# Altium project WiRF.PrjPCB
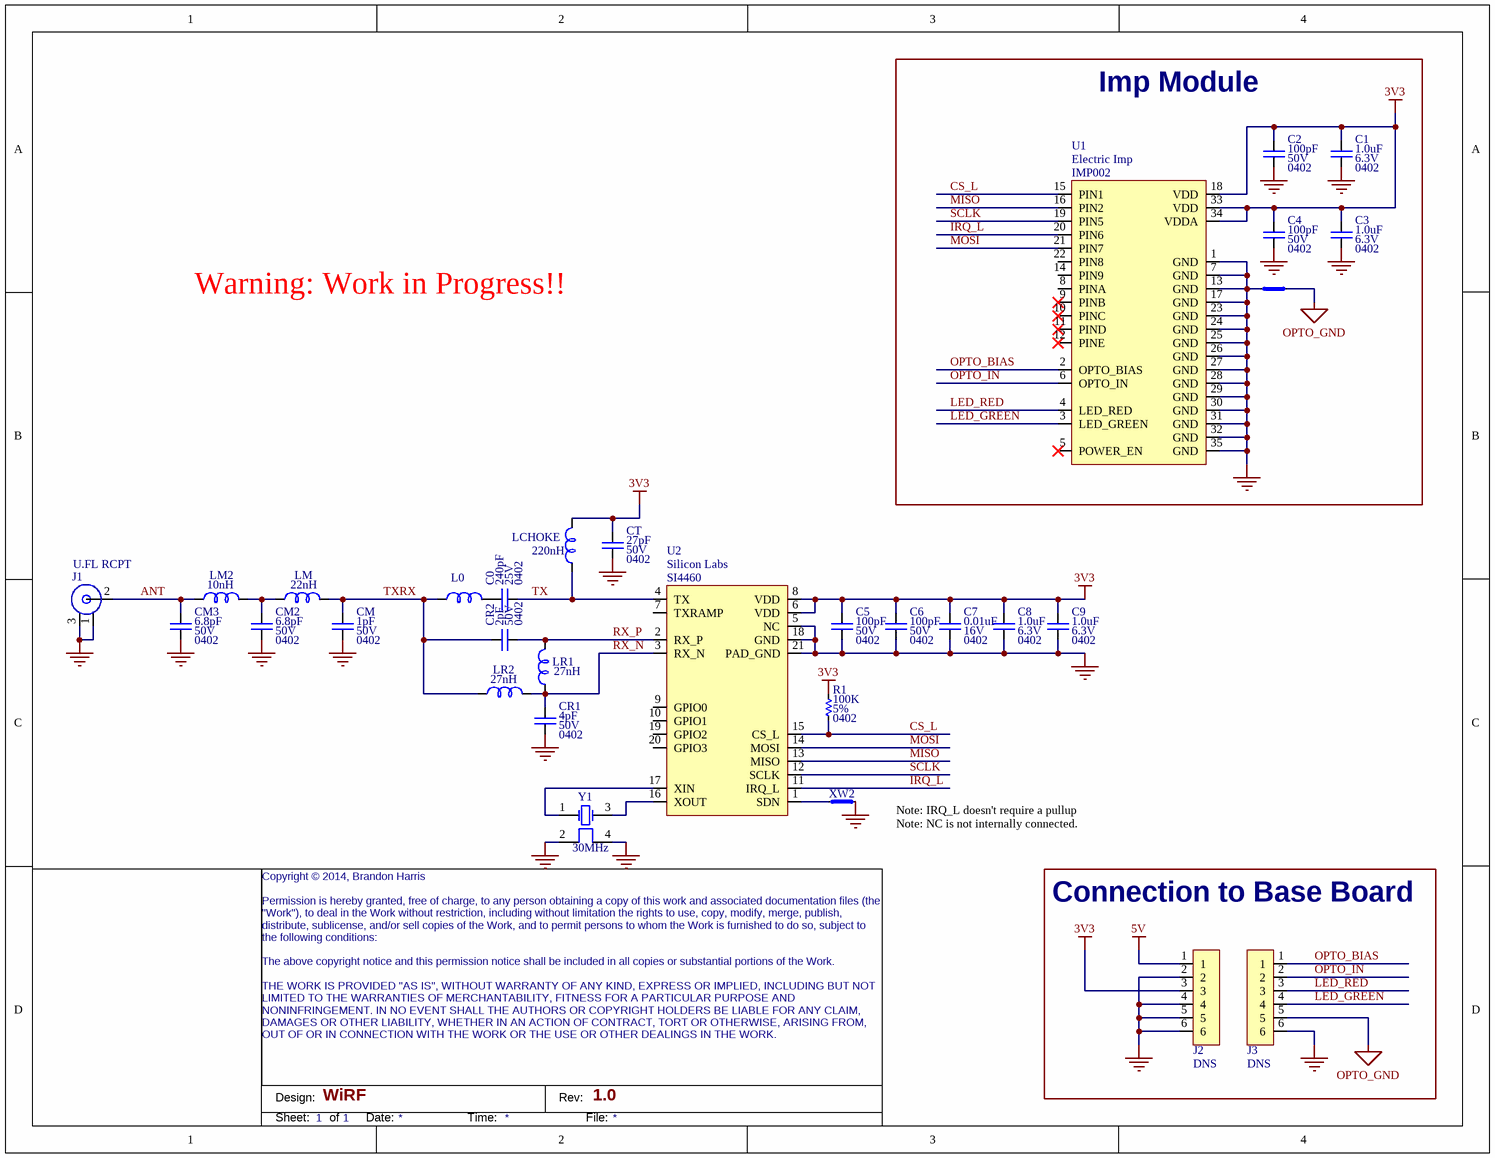
[diagram p0: WiRF.SchDoc]
1 sheet, 31 parts. Net scope: global (net labels, ports and power ports of the same name join across sheets).
Board file: WiRF.PcbDoc

## Sheet WiRF.SchDoc: WiRF
size Letter; Author: Brandon Harris; Revision: 1.0; SheetNumber: 1; SheetTotal: 1; PageSetup: Record=PageOptions|CenterHorizontal=True|CenterVertical=True|PrintScale=0.62|XCorrection=1.00|YCorrection=1.00|PrintKind=0|BorderSize=5000000|LeftOffset=0|BottomOffset=0|Orientation=2|PaperLength=1000|PaperWidth=1000|Scale=100|PaperSource=7|PrintQuality=600|MediaType=1|DitherType=10|PaperKind=Tabloid|PrintScaleMode=1; ProjectName: WiRF

### Parts
C0  value 240pF  Voltage: 25V  Package: 0402  [CAPC1005X07N]  (hidden comment: Ceramic Capacitor)
C1  value 1.0uF  Voltage: 6.3V  Package: 0402  [CAPC1005X07N]  (hidden comment: Ceramic Capacitor)
C2  value 100pF  Voltage: 50V  Package: 0402  [CAPC1005X07N]  (hidden comment: Ceramic Capacitor)
C3  value 1.0uF  Voltage: 6.3V  Package: 0402  [CAPC1005X07N]  (hidden comment: Ceramic Capacitor)
C4  value 100pF  Voltage: 50V  Package: 0402  [CAPC1005X07N]  (hidden comment: Ceramic Capacitor)
C5  value 100pF  Voltage: 50V  Package: 0402  [CAPC1005X07N]  (hidden comment: Ceramic Capacitor)
C6  value 100pF  Voltage: 50V  Package: 0402  [CAPC1005X07N]  (hidden comment: Ceramic Capacitor)
C7  value 0.01uF  Voltage: 16V  Package: 0402  [CAPC1005X07N]  (hidden comment: Ceramic Capacitor)
C8  value 1.0uF  Voltage: 6.3V  Package: 0402  [CAPC1005X07N]  (hidden comment: Ceramic Capacitor)
C9  value 1.0uF  Voltage: 6.3V  Package: 0402  [CAPC1005X07N]  (hidden comment: Ceramic Capacitor)
CM  value 1pF  Voltage: 50V  Package: 0402  [CAPC1005X07N]  (hidden comment: Ceramic Capacitor)
CM2  value 6.8pF  Voltage: 50V  Package: 0402  [CAPC1005X07N]  (hidden comment: Ceramic Capacitor)
CM3  value 6.8pF  Voltage: 50V  Package: 0402  [CAPC1005X07N]  (hidden comment: Ceramic Capacitor)
CR1  value 4pF  Voltage: 50V  Package: 0402  [CAPC1005X07N]  (hidden comment: Ceramic Capacitor)
CR2  value 2pF  Voltage: 50V  Package: 0402  [CAPC1005X07N]  (hidden comment: Ceramic Capacitor)
CT  value 27pF  Voltage: 50V  Package: 0402  [CAPC1005X07N]  (hidden comment: Ceramic Capacitor)
J1  U.FL RCPT  [RF_RCPT_UFL_400X400]
J2  BOMOPTION: DNS  [HDR254P1X6-N]  (hidden comment: Header)  (no BOM)
J3  BOMOPTION: DNS  [HDR254P1X6-N]  (hidden comment: Header)  (no BOM)
L0  Inductor  [INDC2520X23N]  (value not drawn)
LCHOKE  value 220nH  [INDC2520X23N]  (hidden comment: Inductor)
LM  value 22nH  [INDC1005X06N]  (hidden comment: INDUCTOR)
LM2  value 10nH  [INDC1005X06N]  (hidden comment: INDUCTOR)
LR1  value 27nH  [INDC1005X06N]  (hidden comment: INDUCTOR)
LR2  value 27nH  [INDC1005X06N]  (hidden comment: INDUCTOR)
R1  value 100K  Package: 0402  Tolerance: 5%  [RESC1005X04N]  (hidden comment: Resistor)
U1  Manufacturer: Electric Imp  Manufacturer Part Number: IMP002  [IMP_MODULE]  (hidden comment: imp module)
U2  Manufacturer: Silicon Labs  Manufacturer Part Number: SI4460  [QFN50P400X400X90_HS-21N]  (hidden comment: SI446X)
XW1  XW Link  [XW1005-COVERED]  (value not drawn)  (net tie, no BOM)
XW2  XW Link  [XW1005-COVERED]  (value not drawn)  (net tie, no BOM)
Y1  Frequency: 30MHz  [XTAL_25X20X05-4N]  (hidden comment: XTAL_4)

### Blocks framed on the sheet
Imp Module: C1-C4 U1 XW1
Connection to Base Board: J2 J3

### Nets
3V3: C1.2 C2.2 C3.2 C4.2 C5.2 C6.2 C7.2 C8.2 C9.2 CT.2 J2.3 LCHOKE.2 R1.1 U1.18(VDD) U1.33(VDD) U1.34(VDDA) U2.6(VDD) U2.8(VDD)
5V: J2.1
GND: C1.1 C2.1 C3.1 C4.1 C5.1 C6.1 C7.1 C8.1 C9.1 CM.1 CM2.1 CM3.1 CR1.1 CT.1 J1.1(SHLD) J1.3(SHIELD) J2.2 J2.4 J2.5 J2.6 J3.6 U1.1(GND) U1.7(GND) U1.13(GND) U1.17(GND) U1.23(GND) U1.24(GND) U1.25(GND) U1.26(GND) U1.27(GND) U1.28(GND) U1.29(GND) U1.30(GND) U1.31(GND) U1.32(GND) U1.35(GND) U2.5(NC) U2.18(GND) U2.21(PAD_GND) XW1.1 XW2.1 Y1.2(GND) Y1.4(GND)
OPTO_GND: J3.5 XW1.2
ANT: CM3.2 J1.2(RF) LM2.1
CS_L: R1.2 U1.15(PIN1) U2.15(CS_L)
IRQ_L: U1.20(PIN6) U2.11(IRQ_L)
LED_GREEN: J3.4 U1.3(LED_GREEN)
LED_RED: J3.3 U1.4(LED_RED)
MISO: U1.16(PIN2) U2.13(MISO)
MOSI: U1.21(PIN7) U2.14(MOSI)
OPTO_BIAS: J3.1 U1.2(OPTO_BIAS)
OPTO_IN: J3.2 U1.6(OPTO_IN)
RX_N: CR1.2 LR1.1 LR2.2 U2.3(RX_N)
RX_P: CR2.1 LR1.2 U2.2(RX_P)
SCLK: U1.19(PIN5) U2.12(SCLK)
TX: C0.1 LCHOKE.1 U2.4(TX)
TXRX: CM.2 CR2.2 L0.1 LM.2 LR2.1
NetC0_2: C0.2 L0.2
NetCM2_2: CM2.2 LM.1 LM2.2
NetU2_1: U2.1(SDN) XW2.2
NetU2_16: U2.16(XOUT) Y1.3(OSC2)
NetU2_17: U2.17(XIN) Y1.1(OSC1)

Not connected (* = marked no-connect by the designer): U1 5(POWER_EN)* 8(PINA) 9(PINB)* 10(PINC)* 11(PIND)* 12(PINE)* 14(PIN9) 22(PIN8); U2 7(TXRAMP) 9(GPIO0) 10(GPIO1) 19(GPIO2) 20(GPIO3)

### Notes on the sheet
- Warning: Work in Progress!!
- (near XW2) Note: IRQ_L doesn't require a pullup
  Note: NC is not internally connected.
- Copyright © 2014, Brandon Harris
  Permission is hereby granted, free of charge, to any person obtaining a copy of this work and associated documentation files (the "Work"), to deal in the Work without restriction, including without limitation the rights to use, copy, modify, merge, publish, distribute, sublicense, and/or sell copies of the Work, and to permit persons to whom the Work is furnished to do so, subject to the following conditions:
  The above copyright notice and this permission notice shall be included in all copies or substantial portions of the Work.
  THE WORK IS PROVIDED "AS IS", WITHOUT WARRANTY OF ANY KIND, EXPRESS OR IMPLIED, INCLUDING BUT NOT LIMITED TO THE WARRANTIES OF MERCHANTABILITY, FITNESS FOR A PARTICULAR PURPOSE AND NONINFRINGEMENT. IN NO EVENT SHALL THE AUTHORS OR COPYRIGHT HOLDERS BE LIABLE FOR ANY CLAIM, DAMAGES OR OTHER LIABILITY, WHETHER IN AN ACTION OF CONTRACT, TORT OR OTHERWISE, ARISING FROM, OUT OF OR IN CONNECTION WITH THE WORK OR THE USE OR OTHER DEALINGS IN THE WORK.
- Design:
- Rev:
- Sheet:
- of
- Date:
- Time:
- File:

### Library data of the parts
C0 = CAPC00098: CAP,NP0,240pF,5%,25V,0402; Manufacturer: Murata; Manufacturer Part Number: GRM1555C1E241JA01D; Tolerance: 5%; Dielectric: NP0; Part Number: CAPC00098; Supplier 1: Digi-Key; Supplier Part Number 1: 490-6175-1-ND; Supplier Price 1: 0.0174
C1 C3 C8 C9 = CAPC00005: CAP,X5R,1.0uF,10%,6.3V, 0402,#; Manufacturer: Murata; Manufacturer Part Number: GRM155R60J105KE19D; Tolerance: 10%; Dielectric: X5R; Part Number: CAPC00005; Manufacturer 2: Samsung; Manufacturer Part Number 2: CL05A105KQ5NNNC; Supplier 1: Digi-Key; Supplier Part Number 1: 490-1320-1-ND; Supplier Price 1: 0.0087; Supplier 2: Digi-Key; Supplier Part Number 2: 1276-1010-1-ND; Supplier Price 2: 0.009; Stock Quantity: 1000; Stock Date: 3/12/2013
C2 C4-C6 = CAPC00043: CAP,C0G,100pF,5%,50V,0402; Manufacturer: Yageo; Manufacturer Part Number: CC0402JRNPO9BN101; Tolerance: 5%; Dielectric: C0G; Part Number: CAPC00043; Manufacturer 2: Samsung; Manufacturer Part Number 2: CL05C101JB5NNNC; Supplier 1: Digi-Key; Supplier Part Number 1: 311-1024-1-ND; Supplier Price 1: 0.00324; Supplier 2: Digi-Key; Supplier Part Number 2: 1276-1025-1-ND; Supplier Price 2: 0.00324; Stock Quantity: 500; Stock Date: 3/12/2013
C7 = CAPC00026: CAP,X7R,0.01uF,10%,16V,0402,#; Manufacturer: Yageo; Manufacturer Part Number: CC0402KRX7R7BB103; Tolerance: 10%; Dielectric: X7R; Part Number: CAPC00026; Manufacturer 2: AVX; Manufacturer Part Number 2: 0402YC103KAT2A; Supplier 1: Digi-Key; Supplier Part Number 1: 311-1042-1-ND; Supplier Price 1: 0.00309; Supplier 2: Digi-Key; Supplier Part Number 2: 478-1114-1-ND; Supplier Price 2: 0.0036; Stock Quantity: 1000; Stock Date: 3/12/2013
CM = CAPC00081: CAP,C0G,1pF,+/-0.25pF,50V,0402; Manufacturer: Samsung; Manufacturer Part Number: CL05C010CB5NNNC; Tolerance: 0.25p; Dielectric: C0G; Part Number: CAPC00081; Manufacturer 2: Murata; Manufacturer Part Number 2: GRM1555C1H1R0CA01D; Supplier 1: Digi-Key; Supplier Part Number 1: 1276-1595-1-ND; Supplier Price 1: 0.00432; Supplier 2: Digi-Key; Supplier Part Number 2: 490-3199-1-ND; Supplier Price 2: 0.00525
CM2 CM3 = CAPC00042: CAP,C0G,6.8pF,+/-0.5pF,50V,0402; Manufacturer: TDK; Manufacturer Part Number: C1005C0G1H6R8D; Tolerance: 0.5pF; Dielectric: C0G; Part Number: CAPC00042; Manufacturer 2: Murata; Manufacturer Part Number 2: GRM1555C1H6R8DZ01D; Supplier 1: Digi-Key; Supplier Part Number 1: 445-4887-1-ND; Supplier Price 1: 0.0066; Supplier 2: Digi-Key; Supplier Part Number 2: 490-1276-1-ND; Supplier Price 2: 0.00696
CR1 = CAPC00093: CAP,C0G,4pF,±0.25pF,50V,0402; Manufacturer: Samsung; Manufacturer Part Number: CL05C040CB5NCNC; Tolerance: 0.25pF; Dielectric: C0G; Part Number: CAPC00093; Supplier 1: Digi-Key; Supplier Part Number 1: 1276-1600-1-ND; Supplier Price 1: 0.00432
CR2 = CAPC00100: CAP,C0G,2pF,±0.25pF,50V,0402; Manufacturer: Samsung; Manufacturer Part Number: CL05C020CB5NNNC; Tolerance: 0.25pF; Dielectric: C0G; Part Number: CAPC00100; Supplier 1: Digi-Key; Supplier Part Number 1: 1276-1270-1-ND; Supplier Price 1: 0.00525
CT = CAPC00044: CAP,C0G,27pF,5%,50V,0402; Manufacturer: Yageo; Manufacturer Part Number: CC0402JRNPO9BN270; Tolerance: 5%; Dielectric: C0G; Part Number: CAPC00044; Manufacturer 2: Murata; Manufacturer Part Number 2: GRM1555C1H270JA01D; Supplier 1: Digi-Key; Supplier Part Number 1: 311-1019-1-ND; Supplier Price 1: 0.00324; Supplier 2: Digi-Key; Supplier Part Number 2: 490-5869-1-ND; Supplier Price 2: 0.00525
J1 = CON00013: Conn, Coax, U.FL, non-switch, Rcpt, 2.6 x 2.5mm, SMD; Manufacturer: Hirose; Manufacturer Part Number: U.FL-R-SMT(01); Part Number: CON00013; Supplier 1: Digi-Key; Supplier Part Number 1: H9161CT-ND; Supplier Price 1: 0.688; ComponentLink1URL: http://www.digikey.com/product-detail/en/U.FL-R-SMT(10)/H9161CT-ND/2135256
J2 J3 = HDR00020: Spacer, 1x6 Pin, 2.54mm Pitch, 0.661" Stack Height, Vertical, Through Hole; Manufacturer: Harwin; Manufacturer Part Number: M20-9610646; Gender: Male; Number of Columns: 6; Part Number: HDR00020; Connector Type: Spacer; Number of Rows: 1; Number of Positions Loaded: 6; Pitch: 2.54mm; Mounting Type: Through Hole; Orientation: Vertical; Contact Finish: Gold Flash; Supplier 1: Digi-Key; Supplier Part Number 1: 952-1981-ND; Supplier Price 1: 0.3723
L0 LCHOKE = IND00009: IND, 220nH, 10%, 500mA, 280 mOhm, 2520; Manufacturer: Pulse Electronics; Manufacturer Part Number: PE-1008CM221KTT; Part Number: IND00009; Package: 2520; Current: 500mA; Tolerance: 10%; DC Resistance (DCR): 280 mOhm; Supplier 1: Digi-Key; Supplier Part Number 1: 553-2013-1-ND; Supplier Price 1: 0.1995; Stock Quantity: 0; Stock Date: 7/18/2013; ComponentLink1URL: http://www.digikey.com/product-detail/en/PE-1008CM221KTT/553-2013-1-ND/3179372
  L0: Value: 220nH
LM = IND00036: IND, 22nH, 5%, 300mA, 600 mOhm, 0402; Manufacturer: Taiyo Yuden; Manufacturer Part Number: HK100522NJ-T; Part Number: IND00036; Package: 0402; Current: 300mA; Tolerance: 5%; DC Resistance (DCR): 600 mOhm; Supplier 1: Digi-Key; Supplier Part Number 1: 587-1523-1-ND; Supplier Price 1: 0.01125; ComponentLink1URL: http://www.digikey.com/product-detail/en/HK100522NJ-T/587-1523-1-ND/1008138; Current - Saturation: -; Current - Temperature Rise: -
LM2 = IND00008: IND, 10nH, 5%, 340mA, 310 mOhm, 1005; Manufacturer: Taiyo Yuden; Manufacturer Part Number: HK100510NJ-T; Part Number: IND00008; Package: 1005; Current: 340mA; Tolerance: 5%; DC Resistance (DCR): 310 mOhm; Supplier 1: Digi-Key; Supplier Part Number 1: 587-1519-1-ND; Supplier Price 1: 0.01125; Stock Quantity: 0; Stock Date: 7/18/2013; ComponentLink1URL: http://www.digikey.com/product-detail/en/HK100510NJ-T/587-1519-1-ND/1008134
LR1 LR2 = IND00041: IND, 27nH, 5%, 700 mOhm, 0402, 300mA; Manufacturer: Taiyo Yuden; Manufacturer Part Number: HK100527NJ-T; DC Resistance (DCR): 700 mOhm (Max); Part Number: IND00041; Package: 0402; Current: 300mA; Tolerance: 5%; Supplier 1: Digi-Key; Supplier Part Number 1: 587-1524-1-ND; Supplier Price 1: 0.01125; ComponentLink1URL: http://www.digikey.com/product-detail/en/HK100527NJ-T/587-1524-1-ND/1008139; Current - Saturation: -; Current - Temperature Rise: -
R1 = RES00001: RES,100K,5%,0.063W,0402,#; Manufacturer: Samsung; Manufacturer Part Number: RC1005J104CS; Part Number: RES00001; Power: 0.063W; Manufacturer 2: ROHM; Manufacturer Part Number 2: MCR01MRTJ104; Supplier 1: Digi-Key; Supplier Part Number 1: 1276-4424-1-ND; Supplier Price 1: 0.0023; Supplier 2: Digi-Key; Supplier Part Number 2: HM100KCECT-ND; Supplier Price 2: 0.00233; Stock Quantity: 2100; Stock Date: 4/5/2013
U1 = MOD00002: Module, Electric Imp Solder Down with Antenna; Part Number: MOD00002
U2 = IC00162: IC, RF, Sub-GHz Transceiver, QFN20; Part Number: IC00162; Supplier 1: Digi-Key; Supplier Part Number 1: 336-2470-5-ND; Supplier Price 1: 2.0844; ComponentLink1URL: http://www.digikey.com/product-detail/en/SI4460-B1B-FM/336-2470-5-ND/3681118
XW1 XW2 = ELEC00008: Short two wires together; Part Number: ELEC00008
Y1 = XTAL00020: XTAL, 30MHz, 20ppm, 10pF, 2.5x2.0mm, SMD-4; Manufacturer: Abracon; Manufacturer Part Number: ABM10-30.000MHZ-E20-T; Operating Mode: Fundamental; Part Number: XTAL00020; Package: 4-SMD; Frequency Stability: 20ppm; Frequency Tolerance: 20ppm; Load Capacitance: 10pF; Supplier 1: Digi-Key; Supplier Part Number 1: 535-9097-1-ND; Supplier Price 1: 1.196; ComponentLink1URL: http://www.digikey.com/product-detail/en/ABM10-30.000MHZ-E20-T/535-9097-1-ND/675614